# EAGLE design placa (EAGLE 7.1.0)
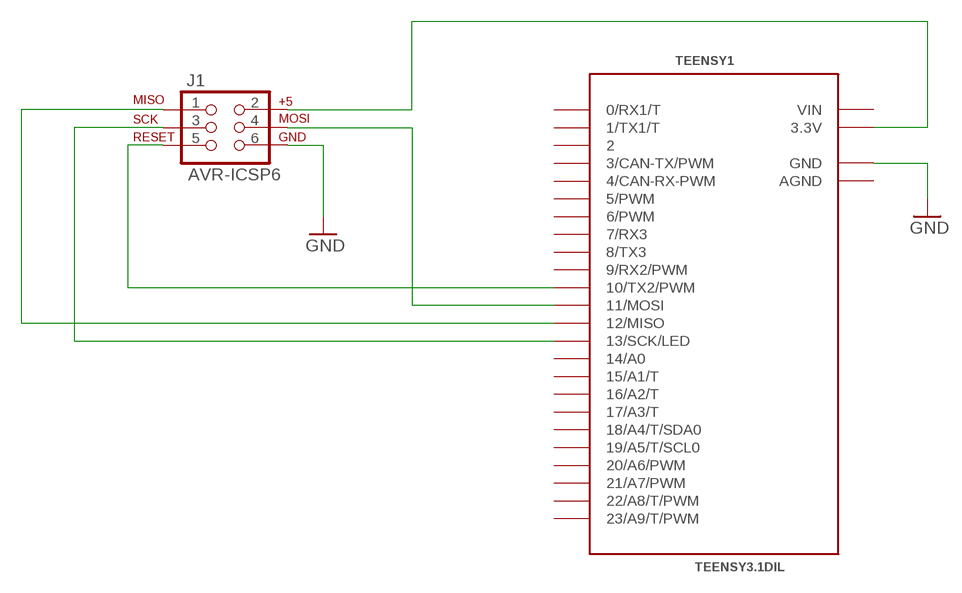
[diagram p0: schematic, sheet 1]

## Parts
J1  AVR-ICSP6  [ICSP6]
TEENSY1  TEENSY3.1DIL  [TEENSY3.1DIL]

## Nets
GND: J1.6 TEENSY1.GND
N$1: J1.2 TEENSY1.3.3V
N$2: J1.4 TEENSY1.11(11/MOSI)
N$4: J1.1 TEENSY1.12(12/MISO)
N$5: J1.3 TEENSY1.13(13/SCK/LED)
N$6: J1.5 TEENSY1.10(10/TX2/PWM)
Unconnected: TEENSY1.0(0/RX1/T) TEENSY1.1(1/TX1/T) TEENSY1.2 TEENSY1.3(3/CAN-TX/PWM) TEENSY1.4(4/CAN-RX-PWM) TEENSY1.5(5/PWM) TEENSY1.6(6/PWM) TEENSY1.7(7/RX3) TEENSY1.8(8/TX3) TEENSY1.9(9/RX2/PWM) TEENSY1.14/A0 TEENSY1.15/A1(15/A1/T) TEENSY1.16/A2(16/A2/T) TEENSY1.17/A3(17/A3/T) TEENSY1.18/A4(18/A4/T/SDA0) TEENSY1.19/A5(19/A5/T/SCL0) TEENSY1.20/A6(20/A6/PWM) TEENSY1.21/A7(21/A7/PWM) TEENSY1.22/A8(22/A8/T/PWM) TEENSY1.23/A9(23/A9/T/PWM)

## Power pins joined to a net without a drawn wire
AGND: TEENSY1.AGND
VIN: TEENSY1.VIN

## Library data of the parts
J1 = iv17:AVR-ICSP6
TEENSY1 = iv17:TEENSY3.1DIL: Teensy 3.1 Actual size is 1.4 by 0.7 inch The Teensy USB Development Board is a complete USB-based microcontoller development system. Version 3.1 features a 32 bit ARM processor.

## Board
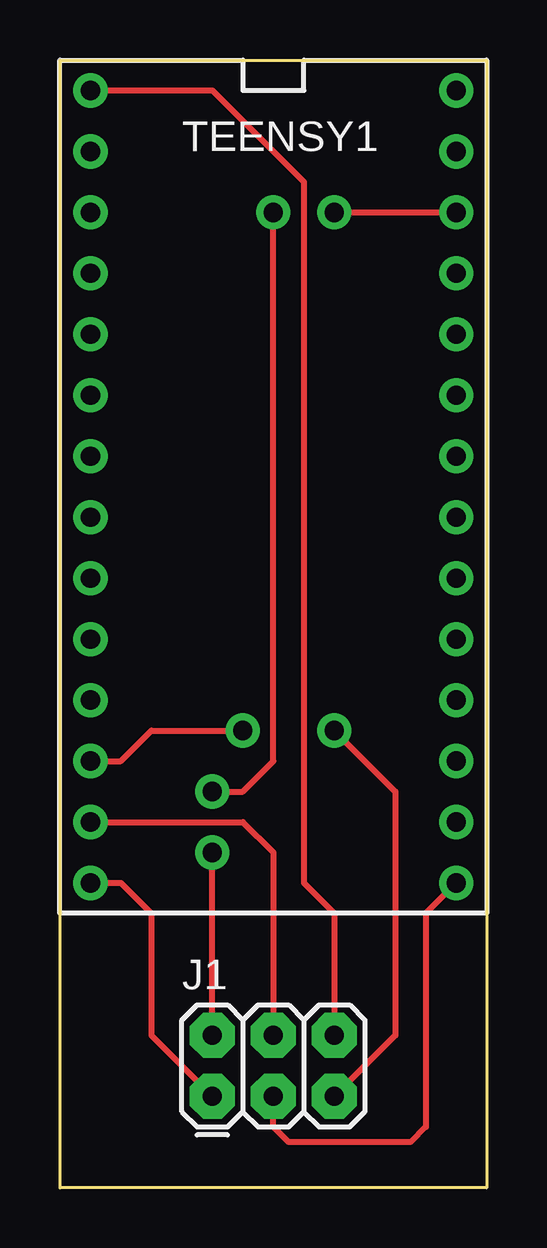
[diagram p1: board, top side]
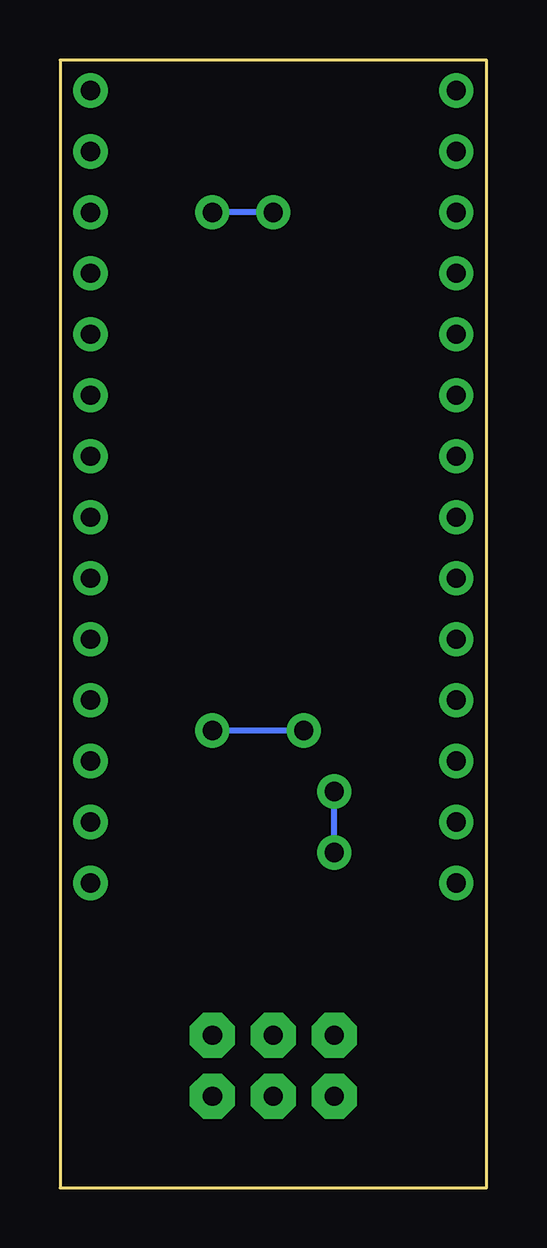
[diagram p2: board, bottom side, seen from below]

Size 17.78 x 46.99 mm. Coordinates in mm from the lower left corner, seen from the top.
Outline: 0,46.99 17.78,46.99 17.78,0 0,0 0,46.99
Copper layers (1*16): Top 0.035mm / dielectric 1.5mm / Bottom 0.035mm
Design rules "default": minimum track width 10mil, minimum drill 24mil, track to track 8mil, track to pad 8mil, pad to pad 8mil, via to via 8mil, smd to smd 8mil, copper to edge 40mil, drill to drill 8mil, minimum pad ring 10mil, minimum via ring 8mil, stop-mask expansion 4mil, vias tented up to drill 0mil, thermal gap 10mil

### Footprints (pad centres in the part's own frame; a part is rotated, then mirrored left to right if it is on the bottom)
ICSP6 = drill 0.8 pad 1.88 octagon: 1 -2.54,-1.27; 2 -2.54,1.27; 3 0,-1.27; 4 0,1.27; 5 2.54,-1.27; 6 2.54,1.27
TEENSY3.1DIL = drill 0.8 pad 1.422: 0 -7.62,13.97; 1 -7.62,11.43; 2 -7.62,8.89; 3 -7.62,6.35; 3.3V 7.62,11.43; 4 -7.62,3.81; 5 -7.62,1.27; 6 -7.62,-1.27; 7 -7.62,-3.81; 8 -7.62,-6.35; 9 -7.62,-8.89; 10 -7.62,-11.43; 11 -7.62,-13.97; 12 -7.62,-16.51; 13 7.62,-16.51; 14/A0 7.62,-13.97; 15/A1 7.62,-11.43; 16/A2 7.62,-8.89; 17/A3 7.62,-6.35; 18/A4 7.62,-3.81; 19/A5 7.62,-1.27; 20/A6 7.62,1.27; 21/A7 7.62,3.81; 22/A8 7.62,6.35; 23/A9 7.62,8.89; AGND 7.62,13.97; GND -7.62,16.51; VIN 7.62,16.51

### Placement (x,y rotation side)
J1  8.89,5.08 0 top
TEENSY1  8.89,29.21 0 top

### Tracks (layer width: path | path; a pad name or v marks a point on that pad's centre or on a via)
GND
  Top 0.254: TEENSY1.GND 6.35,45.72 10.16,41.91 10.16,12.7 11.43,11.43 J1.6
N$1  (via drill 0.8 pad 1.42)
  Top 0.254: J1.2 v6.35,13.97 | v6.35,16.51 7.62,16.51 8.89,17.78 v8.89,40.64 | v11.43,40.64 TEENSY1.3.3V
  Bottom 0.254: v6.35,13.97 v6.35,16.51 | v8.89,40.64 v11.43,40.64
N$2
  Top 0.254: TEENSY1.11 7.62,15.24 8.89,13.97 J1.4
N$4
  Top 0.254: TEENSY1.12 2.54,12.7 3.81,11.43 3.81,6.35 J1.1
N$5
  Top 0.254: TEENSY1.13 15.24,11.43 15.24,2.54 14.61,1.91 9.53,1.91 8.89,2.54 J1.3
N$6  (via drill 0.8 pad 1.42)
  Top 0.254: TEENSY1.10 2.54,17.78 3.81,19.05 v7.62,19.05 | v11.43,19.05 13.97,16.51 13.97,6.35 J1.5
  Bottom 0.254: v7.62,19.05 v11.43,19.05